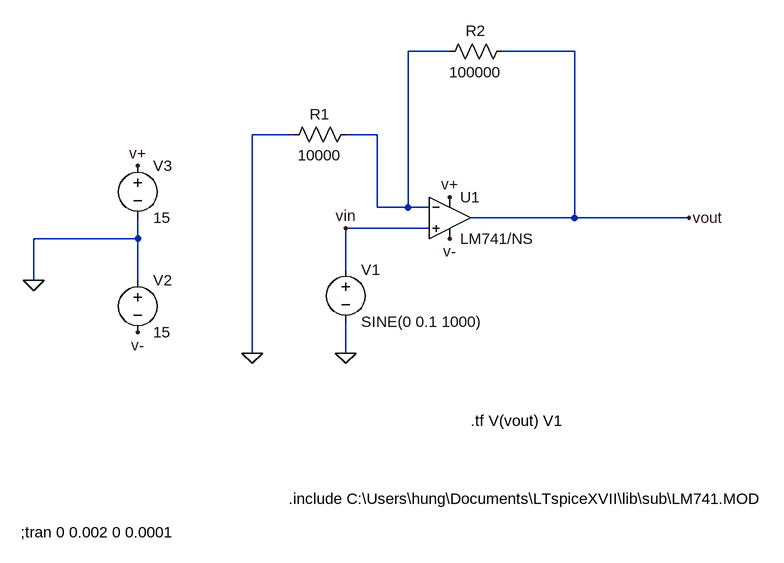
[diagram p0: schematic lab 7 part 2b.asc]
lab 7 part 2b.asc, the LTspice schematic file:
Version 4
SHEET 1 1268 680
WIRE 608 -192 544 -192
WIRE 800 -192 688 -192
WIRE 368 -64 304 -64
WIRE 496 -64 448 -64
WIRE 496 48 496 -64
WIRE 544 48 544 -192
WIRE 544 48 496 48
WIRE 576 48 544 48
WIRE 800 64 800 -192
WIRE 800 64 640 64
WIRE 976 64 800 64
WIRE 576 80 448 80
WIRE 128 96 128 64
WIRE 128 96 -32 96
WIRE 448 144 448 80
WIRE -32 160 -32 96
WIRE 128 160 128 96
WIRE 304 272 304 -64
WIRE 448 272 448 224
FLAG -32 160 0
FLAG 304 272 0
FLAG 448 272 0
FLAG 608 96 v-
FLAG 128 240 v-
FLAG 128 -16 v+
FLAG 608 32 v+
FLAG 976 64 vout
FLAG 448 80 vin
SYMBOL voltage 448 128 R0
WINDOW 123 0 0 Left 0
WINDOW 39 0 0 Left 0
SYMATTR InstName V1
SYMATTR Value SINE(0 0.1 1000)
SYMBOL voltage 128 144 R0
WINDOW 123 0 0 Left 0
WINDOW 39 0 0 Left 0
SYMATTR InstName V2
SYMATTR Value 15
SYMBOL voltage 128 -32 R0
WINDOW 123 0 0 Left 0
WINDOW 39 0 0 Left 0
SYMATTR InstName V3
SYMATTR Value 15
SYMBOL res 464 -80 R90
WINDOW 0 0 56 VBottom 2
WINDOW 3 32 56 VTop 2
SYMATTR InstName R1
SYMATTR Value 10000
SYMBOL res 704 -208 R90
WINDOW 0 0 56 VBottom 2
WINDOW 3 32 56 VTop 2
SYMATTR InstName R2
SYMATTR Value 100000
SYMBOL Opamps\\opamp2 608 0 R0
SYMATTR InstName U1
SYMATTR Value LM741/NS
TEXT -52 548 Left 2 !;tran 0 0.002 0 0.0001
TEXT 360 496 Left 2 !.include C:\\Users\\hung\\Documents\\LTspiceXVII\\lib\\sub\\LM741.MOD
TEXT 640 376 Left 2 !.tf V(vout) V1

The netlist it stands for:
* lab 7 part 2b.asc
V1 vin 0 SINE(0 0.1 1000)
V2 0 v- 15
V3 v+ 0 15
R1 N001 0 10000
R2 vout N001 100000
XU1 vin N001 v+ v- vout LM741/NS  ; pins In+ In- V+ V- OUT
;tran 0 0.002 0 0.0001
.include C:\Users\hung\Documents\LTspiceXVII\lib\sub\LM741.MOD
.tf V(vout) V1
.backanno
.end